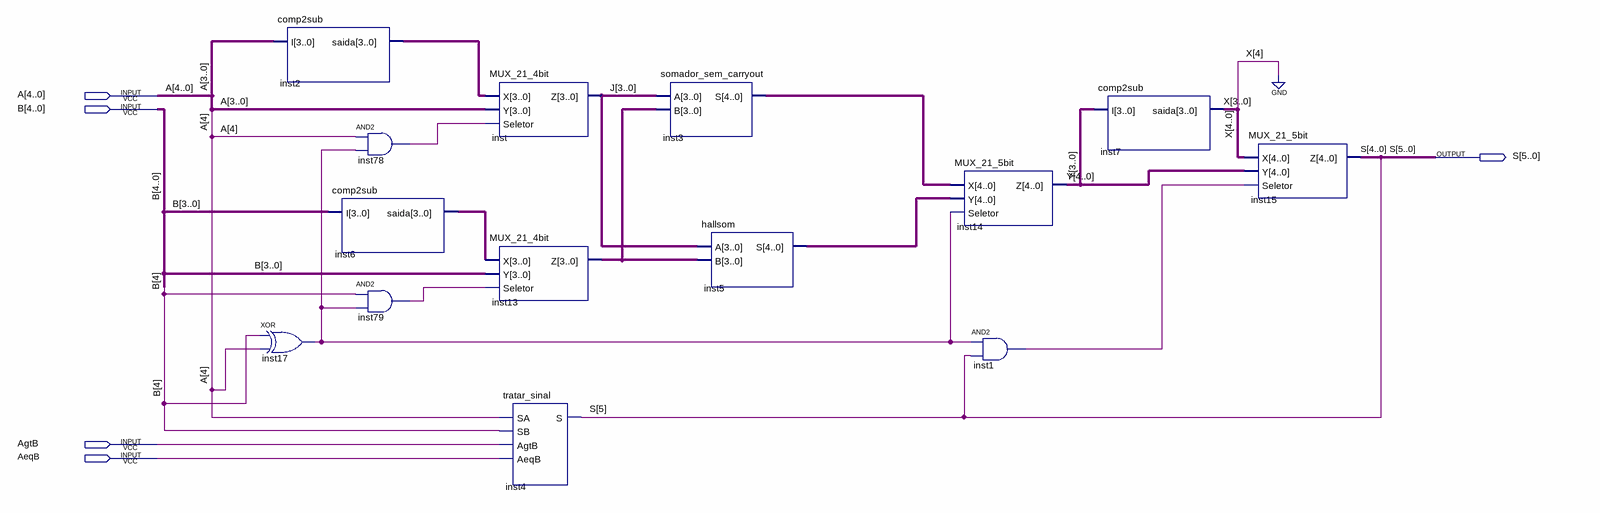
[diagram p0: schematic sheet]
// Quartus schematic subtrator.bdf as structural Verilog: 14 symbols, 5 pins
module subtrator (
  input  [4:0] A,
  input  [4:0] B,
  input  AgtB,
  input  AeqB,
  output [5:0] S
);

  wire inst1_out, inst17_out, inst78_out, inst79_out;
  wire [3:0] inst2_saida, inst6_saida, inst13_z, J, X;
  wire [4:0] inst3_s, inst5_s, Y;

  comp2sub inst2 (.I(A[3:0]), .saida(inst2_saida));
  xor inst17 (inst17_out, B[4], A[4]);
  comp2sub inst6 (.I(B[3:0]), .saida(inst6_saida));
  and inst78 (inst78_out, A[4], inst17_out);
  and inst79 (inst79_out, B[4], inst17_out);
  MUX_21_4bit inst (.X(inst2_saida), .Y(A[3:0]), .Seletor(inst78_out), .Z(J));
  MUX_21_4bit inst13 (.X(inst6_saida), .Y(B[3:0]), .Seletor(inst79_out), .Z(inst13_z));
  tratar_sinal inst4 (.SA(A[4]), .SB(B[4]), .AgtB(AgtB), .AeqB(AeqB), .S(S[5]));
  somador_sem_carryout inst3 (.A(J), .B(inst13_z), .S(inst3_s));
  hallsom inst5 (.A(J), .B(inst13_z), .S(inst5_s));
  MUX_21_5bit inst14 (.X(inst3_s), .Y(inst5_s), .Seletor(inst17_out), .Z(Y));
  and inst1 (inst1_out, inst17_out, S[5]);
  comp2sub inst7 (.I(Y[3:0]), .saida(X));
  MUX_21_5bit inst15 (.X({1'b0, X}), .Y(Y), .Seletor(inst1_out), .Z(S[4:0]));
endmodule
